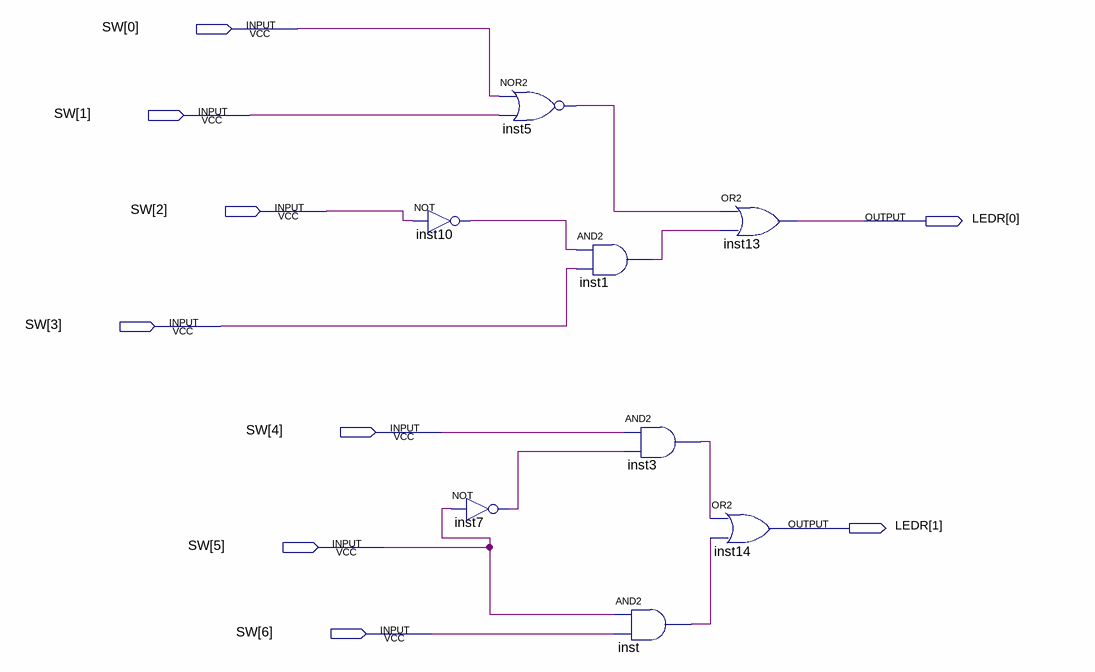
[diagram p0: schematic sheet]
// Quartus schematic lab1.bdf as structural Verilog: 8 symbols, 9 pins
module lab1 (
  input  [6:0] SW,
  output [1:0] LEDR
);

  wire inst1_out, inst3_out, inst5_out, inst7_out, inst10_out, inst_out;

  not inst10 (inst10_out, SW[2]);
  not inst7 (inst7_out, SW[5]);
  nor inst5 (inst5_out, SW[0], SW[1]);
  and inst1 (inst1_out, inst10_out, SW[3]);
  and inst3 (inst3_out, SW[4], inst7_out);
  and inst (inst_out, SW[5], SW[6]);
  or inst14 (LEDR[1], inst3_out, inst_out);
  or inst13 (LEDR[0], inst5_out, inst1_out);
endmodule
